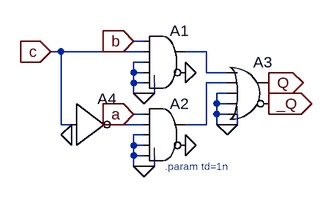
[diagram p0: schematic mux-1bit-2to1.asc]
mux-1bit-2to1.asc, the LTspice schematic file:
Version 4
SHEET 1 880 680
WIRE 144 64 128 64
WIRE 16 80 0 80
WIRE 144 80 16 80
WIRE 240 80 208 80
WIRE 144 96 128 96
WIRE 128 112 128 96
WIRE 144 112 128 112
WIRE 240 112 240 80
WIRE 272 112 240 112
WIRE 128 128 128 112
WIRE 144 128 128 128
WIRE 272 128 240 128
WIRE 128 144 128 128
WIRE 144 144 128 144
WIRE 160 144 160 128
WIRE 160 144 144 144
WIRE 272 144 256 144
WIRE 256 160 256 144
WIRE 272 160 256 160
WIRE 144 176 128 176
WIRE 256 176 256 160
WIRE 272 176 256 176
WIRE 16 192 16 80
WIRE 32 192 16 192
WIRE 144 192 96 192
WIRE 240 192 240 128
WIRE 240 192 208 192
WIRE 256 192 256 176
WIRE 272 192 256 192
WIRE 288 192 288 176
WIRE 288 192 272 192
WIRE 144 208 128 208
WIRE 128 224 128 208
WIRE 144 224 128 224
WIRE 128 240 128 224
WIRE 144 240 128 240
WIRE 128 256 128 240
WIRE 144 256 128 256
WIRE 160 256 160 240
WIRE 160 256 144 256
FLAG 144 144 0
FLAG 208 112 0
FLAG 128 64 b
IOPIN 128 64 In
FLAG 0 80 c
IOPIN 0 80 In
FLAG 144 256 0
FLAG 208 224 0
FLAG 128 176 a
IOPIN 128 176 In
FLAG 272 192 0
FLAG 336 160 _Q
IOPIN 336 160 Out
FLAG 336 128 Q
IOPIN 336 128 Out
FLAG 32 208 0
SYMBOL Digital\\and 176 32 R0
SYMATTR InstName A1
SYMBOL Digital\\or 304 80 R0
SYMATTR InstName A3
SYMBOL Digital\\inv 32 128 R0
SYMATTR InstName A4
SYMBOL Digital\\and 176 144 R0
SYMATTR InstName A2
TEXT 176 256 Left 1 ;.param td=1n

The netlist it stands for:
* mux-1bit-2to1.asc
A1 b c 0 0 0 0 N001 0 AND
A3 N001 N002 0 0 0 _Q Q 0 OR
A4 c 0 0 0 0 N003 0 0 BUF
A2 a N003 0 0 0 0 N002 0 AND
* .param td=1n
.backanno
.end